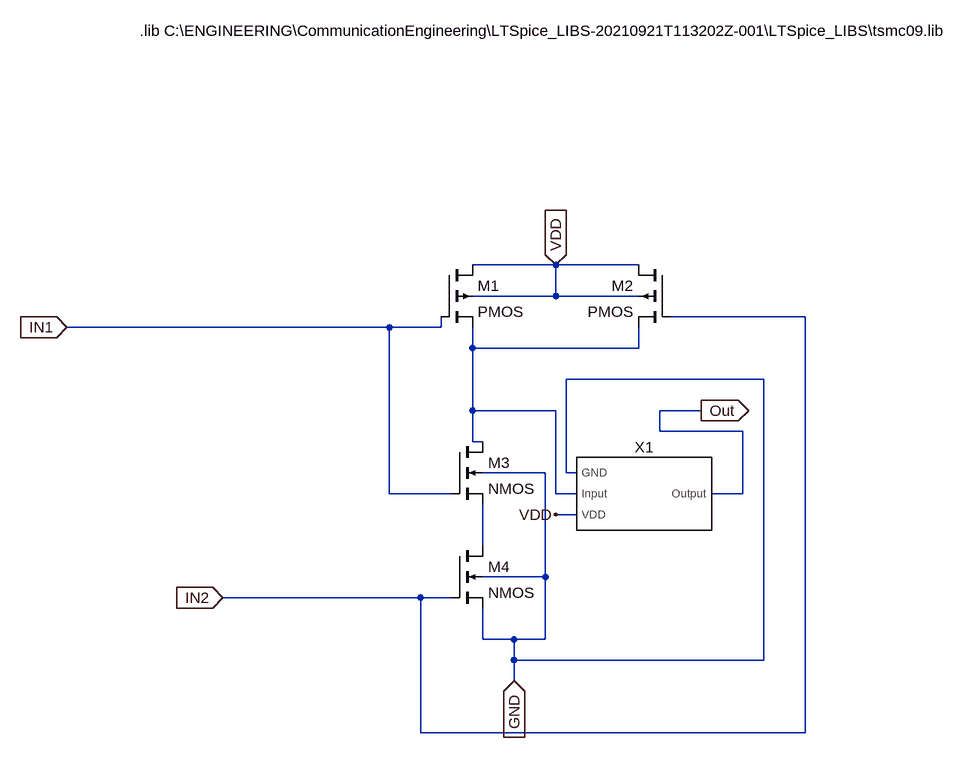
[diagram p0: schematic and_model3EXP.asc]
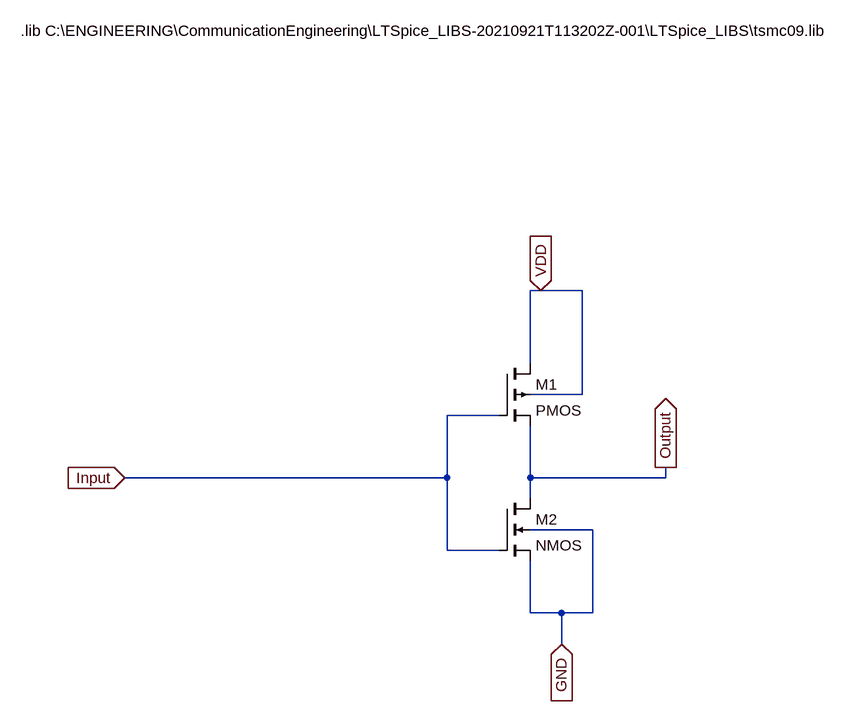
[diagram p1: sub-circuit not_model3exp.asc]
and_model3EXP.asc, the LTspice schematic file:
Version 4
SHEET 1 1644 1040
WIRE 912 288 784 288
WIRE 1040 288 912 288
WIRE 912 336 912 288
WIRE 912 336 784 336
WIRE 1040 336 912 336
WIRE 1296 368 1088 368
WIRE 656 384 160 384
WIRE 736 384 736 368
WIRE 736 384 656 384
WIRE 784 416 784 384
WIRE 1040 416 1040 384
WIRE 1040 416 784 416
WIRE 1232 464 928 464
WIRE 784 512 784 416
WIRE 912 512 784 512
WIRE 1136 512 1072 512
WIRE 1072 544 1072 512
WIRE 1200 544 1072 544
WIRE 784 560 784 512
WIRE 800 560 784 560
WIRE 896 608 800 608
WIRE 928 608 928 464
WIRE 944 608 928 608
WIRE 656 640 656 384
WIRE 752 640 656 640
WIRE 912 640 912 512
WIRE 944 640 912 640
WIRE 1200 640 1200 544
WIRE 1200 640 1152 640
WIRE 944 672 912 672
WIRE 800 720 800 656
WIRE 896 768 896 608
WIRE 896 768 800 768
WIRE 704 800 400 800
WIRE 752 800 704 800
WIRE 800 864 800 816
WIRE 848 864 800 864
WIRE 896 864 896 768
WIRE 896 864 848 864
WIRE 848 896 848 864
WIRE 1232 896 1232 464
WIRE 1232 896 848 896
WIRE 848 928 848 896
WIRE 704 1008 704 800
WIRE 1296 1008 1296 368
WIRE 1296 1008 704 1008
FLAG 1136 512 Out
IOPIN 1136 512 Out
FLAG 160 384 IN1
IOPIN 160 384 In
FLAG 400 800 IN2
IOPIN 400 800 In
FLAG 912 288 VDD
IOPIN 912 288 In
FLAG 848 928 GND
IOPIN 848 928 In
FLAG 912 672 VDD
SYMBOL pmos4 736 288 R0
SYMATTR InstName M1
SYMATTR Value2 l=90n w=440n
SYMBOL pmos4 1088 288 M0
SYMATTR InstName M2
SYMATTR Value2 l=90n w=440n
SYMBOL nmos4 752 560 R0
SYMATTR InstName M3
SYMATTR Value2 l=90n w=220n
SYMBOL nmos4 752 720 R0
SYMATTR InstName M4
SYMATTR Value2 l=90n w=220n
SYMBOL not_model3EXP 1040 640 R0
SYMATTR InstName X1
TEXT 272 -72 Left 2 !.lib C:\\ENGINEERING\\CommunicationEngineering\\LTSpice_LIBS-20210921T113202Z-001\\LTSpice_LIBS\\tsmc09.lib

not_model3exp.asc, the sub-circuit schematic file:
Version 4
SHEET 1 888 680
WIRE 240 -96 224 -96
WIRE 304 -96 240 -96
WIRE 224 16 224 -96
WIRE 304 64 304 -96
WIRE 304 64 224 64
WIRE 176 96 96 96
WIRE 96 192 96 96
WIRE 96 192 -400 192
WIRE 224 192 224 112
WIRE 432 192 432 176
WIRE 432 192 224 192
WIRE 224 224 224 192
WIRE 320 272 224 272
WIRE 96 304 96 192
WIRE 176 304 96 304
WIRE 224 400 224 320
WIRE 272 400 224 400
WIRE 320 400 320 272
WIRE 320 400 272 400
WIRE 272 448 272 400
FLAG -400 192 Input
IOPIN -400 192 In
FLAG 432 176 Output
IOPIN 432 176 Out
FLAG 240 -96 VDD
IOPIN 240 -96 In
FLAG 272 448 GND
IOPIN 272 448 In
SYMBOL pmos4 176 16 R0
SYMATTR InstName M1
SYMATTR Value2 l=90n w=440n
SYMBOL nmos4 176 224 R0
SYMATTR InstName M2
SYMATTR Value2 l=90n w=220n
TEXT -560 -496 Left 2 !.lib C:\\ENGINEERING\\CommunicationEngineering\\LTSpice_LIBS-20210921T113202Z-001\\LTSpice_LIBS\\tsmc09.lib

The netlist it stands for:
* and_model3EXP.asc
M1 VDD IN1 N001 VDD PMOS l=90n w=440n
M2 VDD IN2 N001 VDD PMOS l=90n w=440n
M3 N001 IN1 N002 GND NMOS l=90n w=220n
M4 N002 IN2 GND GND NMOS l=90n w=220n
XX1 GND N001 VDD Out not_model3exp

* block symbol definitions
.subckt not_model3exp GND Input VDD Output
M1 VDD Input Output VDD PMOS l=90n w=440n
M2 Output Input GND GND NMOS l=90n w=220n
.lib C:\ENGINEERING\CommunicationEngineering\LTSpice_LIBS-20210921T113202Z-001\LTSpice_LIBS\tsmc09.lib
.ends not_model3exp

.model NMOS NMOS
.model PMOS PMOS
.lib standard.mos
.lib C:\ENGINEERING\CommunicationEngineering\LTSpice_LIBS-20210921T113202Z-001\LTSpice_LIBS\tsmc09.lib
.backanno
.end